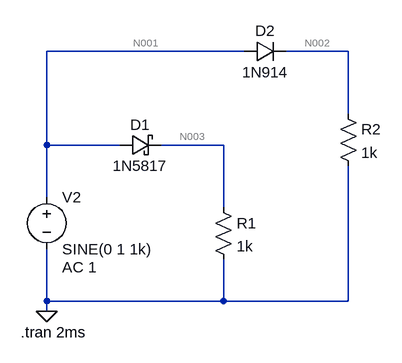
[diagram p0: schematic Draft5.asc]
Draft5.asc, the LTspice schematic file:
Version 4
SHEET 1 1080 680
WIRE 352 -528 48 -528
WIRE 512 -528 416 -528
WIRE 512 -432 512 -528
WIRE 48 -384 48 -528
WIRE 160 -384 48 -384
WIRE 320 -384 224 -384
WIRE 48 -304 48 -384
WIRE 320 -288 320 -384
WIRE 48 -144 48 -224
WIRE 320 -144 320 -208
WIRE 320 -144 48 -144
WIRE 512 -144 512 -352
WIRE 512 -144 320 -144
WIRE 48 -128 48 -144
FLAG 48 -128 0
SYMBOL voltage 48 -320 R0
WINDOW 123 24 124 Left 2
WINDOW 39 0 0 Left 0
SYMATTR InstName V2
SYMATTR Value SINE(0 1 1k)
SYMATTR Value2 AC 1
SYMBOL res 304 -304 R0
SYMATTR InstName R1
SYMATTR Value 1k
SYMBOL schottky 160 -368 R270
WINDOW 0 32 32 VTop 2
WINDOW 3 0 32 VBottom 2
SYMATTR InstName D1
SYMATTR Value 1N5817
SYMATTR Description Diode
SYMATTR Type diode
SYMBOL res 496 -448 R0
SYMATTR InstName R2
SYMATTR Value 1k
SYMBOL diode 352 -512 R270
WINDOW 0 32 32 VTop 2
WINDOW 3 0 32 VBottom 2
SYMATTR InstName D2
SYMATTR Value 1N914
TEXT 8 -96 Left 2 !.tran 2ms

The netlist it stands for:
* Draft5.asc
V2 N001 0 SINE(0 1 1k) AC 1
R1 N003 0 1k
D1 N001 N003 1N5817
R2 N002 0 1k
D2 N001 N002 1N914
.model D D
.lib standard.dio
.tran 2ms
.backanno
.end

* Results of the author's LTspice run, read from the files saved beside the schematic
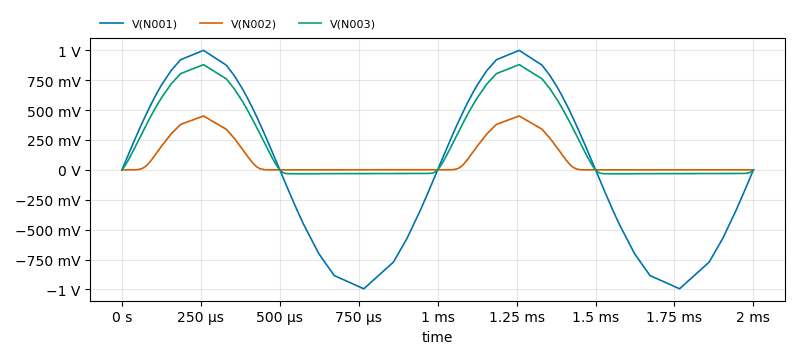
[diagram p1: Transient Analysis of Draft5.asc, plotted from the saved traces]
* Transient Analysis, 1 run:
*   V(N001): min -994.2 mV, max 998.4 mV, average 3.355 mV, rms 698.1 mV, last 0 V
*   V(N002): min -26.38 µV, max 450 mV, average 99.84 mV, rms 185.3 mV, last 25.14 µV
*   V(N003): min -32.75 mV, max 879 mV, average 252.8 mV, rms 427.6 mV, last 336.6 µV